# Altium schematic sheet CPU.SchDoc: RB25DET - CPU
size A3; Author: Dan Visser; CompanyName: DIYEFI; DrawnBy: Dan Visser; Engineer: Dan Visser; Address1: Drawn By:; Address2: Dan Visser; DocumentNumber: A; Revision: 0.1; SheetNumber: 1; SheetTotal: 12
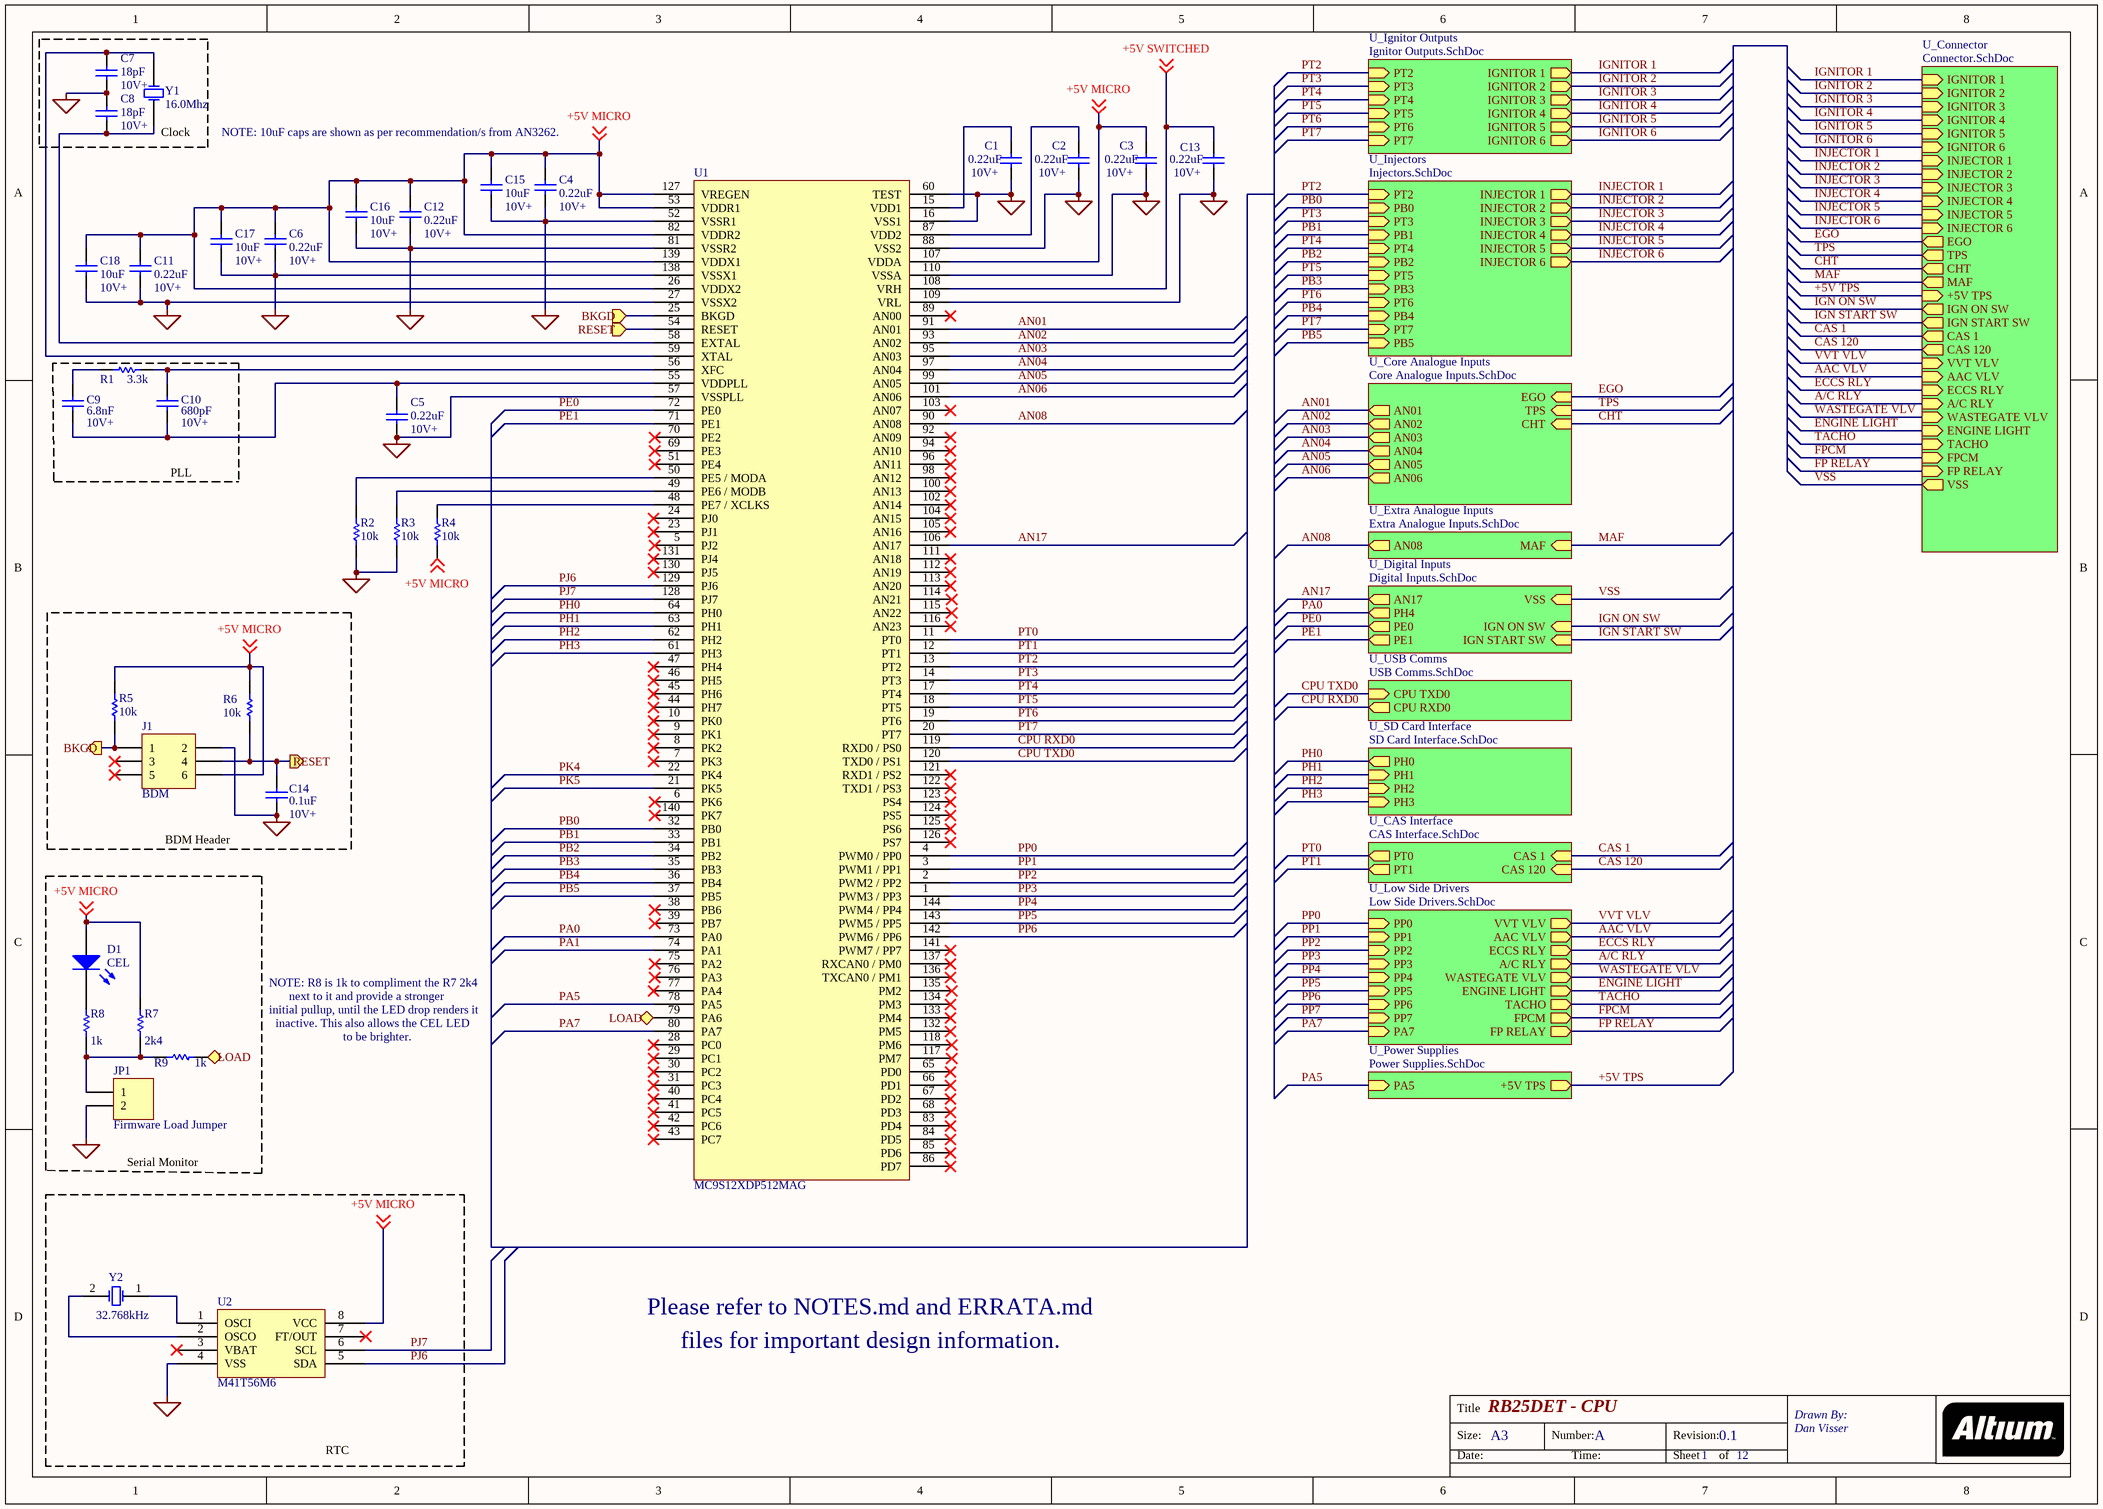
[diagram p0: CPU.SchDoc]

## Parts
C1  value 0.22uF  [RAD-0.3]
C2  value 0.22uF  [RAD-0.3]
C3  value 0.22uF  [RAD-0.3]
C4  value 0.22uF  [RAD-0.3]
C5  value 0.22uF  [RAD-0.3]
C6  value 0.22uF  [RAD-0.3]
C7  value 18pF  [RAD-0.3]
C8  value 18pF  [RAD-0.3]
C9  value 6.8nF  [RAD-0.3]
C10  value 680pF  [RAD-0.3]
C11  value 0.22uF  [RAD-0.3]
C12  value 0.22uF  [RAD-0.3]
C13  value 0.22uF  [RAD-0.3]
C14  value 0.1uF  [RAD-0.3]
C15  value 10uF  [RAD-0.3]
C16  value 10uF  [RAD-0.3]
C17  value 10uF  [RAD-0.3]
C18  value 10uF  [RAD-0.3]
D1  CEL  [LED-0]
J1  BDM  [HDR2X3]
JP1  Firmware Load Jumper  [HDR1X2]
R1  value 3.3k  [AXIAL-0.3]
R2  value 10k  [AXIAL-0.3]
R3  value 10k  [AXIAL-0.3]
R4  value 10k  [AXIAL-0.3]
R5  value 10k  [AXIAL-0.3]
R6  value 10k  [AXIAL-0.3]
R7  value 2k4  [AXIAL-0.3]
R8  value 1k  [AXIAL-0.3]
R9  value 1k  [AXIAL-0.3]
U1  MC9S12XDP512MAG
U2  M41T56M6
Y1  16.0Mhz  [R38]
Y2  32.768kHz  [R38]

## Blocks framed on the sheet
Serial Monitor: D1 JP1 R7-R9
RTC: U2 Y2

## Sub-sheets
U_CAS Interface = CAS Interface.SchDoc: PT1 (out), PT0 (out), CAS 120 (in), CAS 1 (in)
U_Connector = Connector.SchDoc: INJECTOR 1 (in), INJECTOR 2 (in), INJECTOR 3 (in), INJECTOR 4 (in), INJECTOR 5 (in), INJECTOR 6 (in), FP RELAY (in), IGNITOR 1 (in), CAS 1 (out), CAS 120 (out), CHT (out), TPS (out), EGO (out), MAF (out), IGNITOR 2 (in), IGNITOR 3 (in), IGNITOR 4 (in), IGNITOR 5 (in), IGNITOR 6 (in), +5V TPS (in), IGN ON SW (out), IGN START SW (out), FPCM (in), TACHO (in), ENGINE LIGHT (in), WASTEGATE VLV (in), A/C RLY (in), ECCS RLY (in), AAC VLV (in), VVT VLV (in), VSS (out)
U_Core Analogue Inputs = Core Analogue Inputs.SchDoc: AN01 (out), AN02 (out), AN03 (out), AN04 (out), EGO (in), TPS (in), CHT (in), AN05 (out), AN06 (out)
U_Digital Inputs = Digital Inputs.SchDoc: PE0 (out), PE1 (out), IGN ON SW (in), IGN START SW (in), PH4 (out), AN17 (out), VSS (in)
U_Extra Analogue Inputs = Extra Analogue Inputs.SchDoc: AN08 (out), MAF (in)
U_Ignitor Outputs = Ignitor Outputs.SchDoc: PT3 (in), PT2 (in), PT4 (in), PT5 (in), PT7 (in), PT6 (in), IGNITOR 1 (out), IGNITOR 2 (out), IGNITOR 3 (out), IGNITOR 4 (out), IGNITOR 5 (out), IGNITOR 6 (out)
U_Injectors = Injectors.SchDoc: PB0 (in), PB1 (in), PB2 (in), PB5 (in), PT7 (in), INJECTOR 3 (out), PB4 (in), PT6 (in), INJECTOR 5 (out), INJECTOR 2 (out), INJECTOR 1 (out), INJECTOR 4 (out), PT5 (in), PB3 (in), PT2 (in), PT3 (in), PT4 (in), INJECTOR 6 (out)
U_Low Side Drivers = Low Side Drivers.SchDoc: PA7 (in), FP RELAY (out), PP4 (in), PP3 (in), PP2 (in), PP1 (in), PP0 (in), VVT VLV (out), AAC VLV (out), ECCS RLY (out), A/C RLY (out), WASTEGATE VLV (out), PP5 (in), PP6 (in), ENGINE LIGHT (out), TACHO (out), FPCM (out), PP7 (in)
U_Power Supplies = Power Supplies.SchDoc: PA5 (in), +5V TPS (out)
U_SD Card Interface = SD Card Interface.SchDoc: PH0 (out), PH1 (in), PH2 (in), PH3 (in)
U_USB Comms = USB Comms.SchDoc: CPU TXD0 (in), CPU RXD0 (out)

## Ports
BKGD (in), BKGD (out), LOAD (bidir), RESET (in), RESET (out)

## Nets
NetC1_1: C1.1 C2.1 C3.1 C4.1 C5.2 C6.1 C7.1 C8.2 C11.1 C12.1 C13.1 C14.2 C15.1 C16.1 C17.1 C18.1 J1.2 JP1.2 R2.1 R3.1 U1.16(VSS1) U1.27(VSSX2) U1.52(VSSR1) U1.57(VSSPLL) U1.60(TEST) U1.81(VSSR2) U1.88(VSS2) U1.109(VRL) U1.110(VSSA) U1.138(VSSX1) U2.4(VSS)
+5V MICRO: C3.2 C4.2 C6.2 C11.2 C12.2 C15.2 C16.2 C17.2 C18.2 D1.1(A) J1.6 R4.1 R5.2 R6.2 R7.2 U1.26(VDDX2) U1.53(VDDR1) U1.82(VDDR2) U1.107(VDDA) U1.127(VREGEN) U1.139(VDDX1) U2.8(VCC) ; off-sheet +5V MICRO
+5V SWITCHED: C13.2 U1.108(VRH) ; off-sheet +5V SWITCHED
+5V TPS: sheet U_Power Supplies/+5V TPS, sheet U_Connector/+5V TPS
A/C RLY: sheet U_Connector/A/C RLY, sheet U_Low Side Drivers/A/C RLY
AAC VLV: sheet U_Connector/AAC VLV, sheet U_Low Side Drivers/AAC VLV
AN01: U1.91(AN01) ; sheet U_Core Analogue Inputs/AN01
AN02: U1.93(AN02) ; sheet U_Core Analogue Inputs/AN02
AN03: U1.95(AN03) ; sheet U_Core Analogue Inputs/AN03
AN04: U1.97(AN04) ; sheet U_Core Analogue Inputs/AN04
AN05: U1.99(AN05) ; sheet U_Core Analogue Inputs/AN05
AN06: U1.101(AN06) ; sheet U_Core Analogue Inputs/AN06
AN08: U1.90(AN08) ; sheet U_Extra Analogue Inputs/AN08
AN17: U1.106(AN17) ; sheet U_Digital Inputs/AN17
BKGD: J1.1 R5.1 U1.25(BKGD) ; port BKGD
CAS 1: sheet U_CAS Interface/CAS 1, sheet U_Connector/CAS 1
CAS 120: sheet U_CAS Interface/CAS 120, sheet U_Connector/CAS 120
CHT: sheet U_Connector/CHT, sheet U_Core Analogue Inputs/CHT
CPU RXD0: U1.119(RXD0_/_PS0) ; sheet U_USB Comms/CPU RXD0
CPU TXD0: U1.120(TXD0_/_PS1) ; sheet U_USB Comms/CPU TXD0
ECCS RLY: sheet U_Connector/ECCS RLY, sheet U_Low Side Drivers/ECCS RLY
EGO: sheet U_Connector/EGO, sheet U_Core Analogue Inputs/EGO
ENGINE LIGHT: sheet U_Connector/ENGINE LIGHT, sheet U_Low Side Drivers/ENGINE LIGHT
FP RELAY: sheet U_Connector/FP RELAY, sheet U_Low Side Drivers/FP RELAY
FPCM: sheet U_Connector/FPCM, sheet U_Low Side Drivers/FPCM
IGN ON SW: sheet U_Digital Inputs/IGN ON SW, sheet U_Connector/IGN ON SW
IGN START SW: sheet U_Digital Inputs/IGN START SW, sheet U_Connector/IGN START SW
IGNITOR 1: sheet U_Ignitor Outputs/IGNITOR 1, sheet U_Connector/IGNITOR 1
IGNITOR 2: sheet U_Ignitor Outputs/IGNITOR 2, sheet U_Connector/IGNITOR 2
IGNITOR 3: sheet U_Ignitor Outputs/IGNITOR 3, sheet U_Connector/IGNITOR 3
IGNITOR 4: sheet U_Ignitor Outputs/IGNITOR 4, sheet U_Connector/IGNITOR 4
IGNITOR 5: sheet U_Ignitor Outputs/IGNITOR 5, sheet U_Connector/IGNITOR 5
IGNITOR 6: sheet U_Ignitor Outputs/IGNITOR 6, sheet U_Connector/IGNITOR 6
INJECTOR 1: sheet U_Injectors/INJECTOR 1, sheet U_Connector/INJECTOR 1
INJECTOR 2: sheet U_Injectors/INJECTOR 2, sheet U_Connector/INJECTOR 2
INJECTOR 3: sheet U_Injectors/INJECTOR 3, sheet U_Connector/INJECTOR 3
INJECTOR 4: sheet U_Injectors/INJECTOR 4, sheet U_Connector/INJECTOR 4
INJECTOR 5: sheet U_Injectors/INJECTOR 5, sheet U_Connector/INJECTOR 5
INJECTOR 6: sheet U_Injectors/INJECTOR 6, sheet U_Connector/INJECTOR 6
LOAD: R9.2 U1.79(PA6) ; port LOAD
MAF: sheet U_Connector/MAF, sheet U_Extra Analogue Inputs/MAF
PA0: U1.73(PA0) ; sheet U_Digital Inputs/PH4
PA1: U1.74(PA1)
PA5: U1.78(PA5) ; sheet U_Power Supplies/PA5
PA7: U1.80(PA7) ; sheet U_Low Side Drivers/PA7
PB0: U1.32(PB0) ; sheet U_Injectors/PB0
PB1: U1.33(PB1) ; sheet U_Injectors/PB1
PB2: U1.34(PB2) ; sheet U_Injectors/PB2
PB3: U1.35(PB3) ; sheet U_Injectors/PB3
PB4: U1.36(PB4) ; sheet U_Injectors/PB4
PB5: U1.37(PB5) ; sheet U_Injectors/PB5
PE0: U1.72(PE0) ; sheet U_Digital Inputs/PE0
PE1: U1.71(PE1) ; sheet U_Digital Inputs/PE1
PH0: U1.64(PH0) ; sheet U_SD Card Interface/PH0
PH1: U1.63(PH1) ; sheet U_SD Card Interface/PH1
PH2: U1.62(PH2) ; sheet U_SD Card Interface/PH2
PH3: U1.61(PH3) ; sheet U_SD Card Interface/PH3
PJ6: U1.129(PJ6) U2.5(SDA)
PJ7: U1.128(PJ7) U2.6(SCL)
PK4: U1.22(PK4)
PK5: U1.21(PK5)
PP0: U1.4(PWM0_/_PP0) ; sheet U_Low Side Drivers/PP0
PP1: U1.3(PWM1_/_PP1) ; sheet U_Low Side Drivers/PP1
PP2: U1.2(PWM2_/_PP2) ; sheet U_Low Side Drivers/PP2
PP3: U1.1(PWM3_/_PP3) ; sheet U_Low Side Drivers/PP3
PP4: U1.144(PWM4_/_PP4) ; sheet U_Low Side Drivers/PP4
PP5: U1.143(PWM5_/_PP5) ; sheet U_Low Side Drivers/PP5
PP6: U1.142(PWM6_/_PP6) ; sheet U_Low Side Drivers/PP6
PP7: sheet U_Low Side Drivers/PP7
PT0: U1.11(PT0) ; sheet U_CAS Interface/PT0
PT1: U1.12(PT1) ; sheet U_CAS Interface/PT1
PT2: U1.13(PT2) ; sheet U_Ignitor Outputs/PT2, sheet U_Injectors/PT2
PT3: U1.14(PT3) ; sheet U_Ignitor Outputs/PT3, sheet U_Injectors/PT3
PT4: U1.17(PT4) ; sheet U_Ignitor Outputs/PT4, sheet U_Injectors/PT4
PT5: U1.18(PT5) ; sheet U_Ignitor Outputs/PT5, sheet U_Injectors/PT5
PT6: U1.19(PT6) ; sheet U_Ignitor Outputs/PT6, sheet U_Injectors/PT6
PT7: U1.20(PT7) ; sheet U_Ignitor Outputs/PT7, sheet U_Injectors/PT7
RESET: C14.1 J1.4 R6.1 U1.54(RESET) ; port RESET
TACHO: sheet U_Connector/TACHO, sheet U_Low Side Drivers/TACHO
TPS: sheet U_Connector/TPS, sheet U_Core Analogue Inputs/TPS
VSS: sheet U_Digital Inputs/VSS, sheet U_Connector/VSS
VVT VLV: sheet U_Connector/VVT VLV, sheet U_Low Side Drivers/VVT VLV
WASTEGATE VLV: sheet U_Connector/WASTEGATE VLV, sheet U_Low Side Drivers/WASTEGATE VLV
NetC1_2: C1.2 U1.15(VDD1)
NetC2_2: C2.2 U1.87(VDD2)
NetC5_1: C5.1 C9.1 C10.1 U1.55(VDDPLL)
NetC7_2: C7.2 U1.59(XTAL) Y1.2(OSC2)
NetC8_1: C8.1 U1.58(EXTAL) Y1.1(OSC1)
NetC9_2: C9.2 R1.1
NetC10_2: C10.2 R1.2 U1.56(XFC)
NetD1_2: D1.2(K) R8.2
NetJP1_1: JP1.1 R7.1 R8.1 R9.1
NetR2_2: R2.2 U1.50(PE5_/_MODA)
NetR3_2: R3.2 U1.49(PE6_/_MODB)
NetR4_2: R4.2 U1.48(PE7_/_XCLKS)
NetU2_1: U2.1(OSCI) Y2.1(OSC1)
NetU2_2: U2.2(OSCO) Y2.2(OSC2)

Not connected (* = marked no-connect by the designer): J1 3* 5*; U1 5(PJ2) 6(PK6) 7(PK3)* 8(PK2)* 9(PK1)* 10(PK0)* 23(PJ1)* 24(PJ0)* 28(PC0)* 29(PC1)* 30(PC2)* 31(PC3)* 38(PB6) 39(PB7) 40(PC4)* 41(PC5)* 42(PC6)* 43(PC7)* 44(PH7)* 45(PH6)* 46(PH5)* 47(PH4)* 51(PE4) 65(PD0)* 66(PD1)* 67(PD2)* 68(PD3)* 69(PE3) 70(PE2) 75(PA2) 76(PA3) 77(PA4)* 83(PD4)* 84(PD5)* 85(PD6)* 86(PD7)* 89(AN00)* 92(AN09)* 94(AN10)* 96(AN11)* 98(AN12)* 100(AN13)* 102(AN14)* 103(AN07)* 104(AN15)* 105(AN16)* 111(AN18)* 112(AN19)* 113(AN20)* 114(AN21) 115(AN22) 116(AN23)* 117(PM7) 118(PM6) 121(RXD1_/_PS2)* 122(TXD1_/_PS3)* 123(PS4)* 124(PS5)* 125(PS6)* 126(PS7)* 130(PJ5)* 131(PJ4)* 132(PM5)* 133(PM4)* 134(PM3)* 135(PM2) 136(TXCAN0_/_PM1)* 137(RXCAN0_/_PM0)* 140(PK7) 141(PWM7_/_PP7)*; U2 3(VBAT)* 7(FT/OUT)*

## Notes on the sheet
- 10V+
- (near Y1) Clock
- NOTE: 10uF caps are shown as per recommendation/s from AN3262.
- (near C1) 10V+
- (near C12) 10V+
- (near C4) 10V+
- (near C11) 10V+
- (near C6) 10V+
- (near C9) 10V+
- (near C10) 10V+
- (near C5) 10V+
- PLL
- BDM Header
- (near C14) 10V+
- NOTE: R8 is 1k to compliment the R7 2k4
- initial pullup, until the LED drop renders it
- inactive. This also allows the CEL LED
- next to it and provide a stronger
- to be brighter.
- Please refer to NOTES.md and ERRATA.md
- files for important design information.
- Title
- Size:
- Date:
- A3
- Number:
- Time:
- Revision:
- Sheet
- of

## Library data of the parts
C1-C18 = Cap: Capacitor; Published: 8-Jun-2000; LatestRevisionDate: 17-Jul-2002; LatestRevisionNote: Re-released for DXP Platform.; PackageReference: RAD-0.3; Publisher: Altium Limited; PackageDescription: Radial Cap, Thru-Hole; 2 Leads; 0.3 in Pin Spacing
D1 = LED0: 0805 Package; Published: 8-Jun-2000; LatestRevisionDate: 08-Jul-2005; LatestRevisionNote: Mech Layer 1 removed.; PackageReference: LED-0; Publisher: Altium Limited; PackageDescription: LED; 2 Leads
J1 = Header 3X2: Header, 3-Pin, Dual row; LatestRevisionDate: 17-Jul-2002; LatestRevisionNote: Re-released for DXP Platform.; Publisher: Altium Limited
JP1 = Header 2: Header, 2-Pin; LatestRevisionDate: 17-Jul-2002; LatestRevisionNote: Re-released for DXP Platform.; Publisher: Altium Limited
R1-R9 = Res1: Resistor; Published: 8-Jun-2000; LatestRevisionDate: 17-Jul-2002; LatestRevisionNote: Re-released for DXP Platform.; PackageReference: AXIAL-0.3; Publisher: Altium Limited; PackageDescription: Axial Device, Thru-Hole; 2 Leads; 0.3 in Pin Spacing
U1 = MC9S12XDP512VAG
U2 = M41T56M6E
Y1 Y2 = XTAL: Crystal Oscillator; Published: 8-Jun-2000; LatestRevisionDate: 17-Jul-2002; LatestRevisionNote: Re-released for DXP Platform.; PackageReference: R38; Publisher: Altium Limited; PackageDescription: Crystal, Thru-Hole; 2 Leads; Body 3.1 x 8.2 mm (Dia.xH)